# Altium project PCB_Project_Dangrangto.PrjPcb
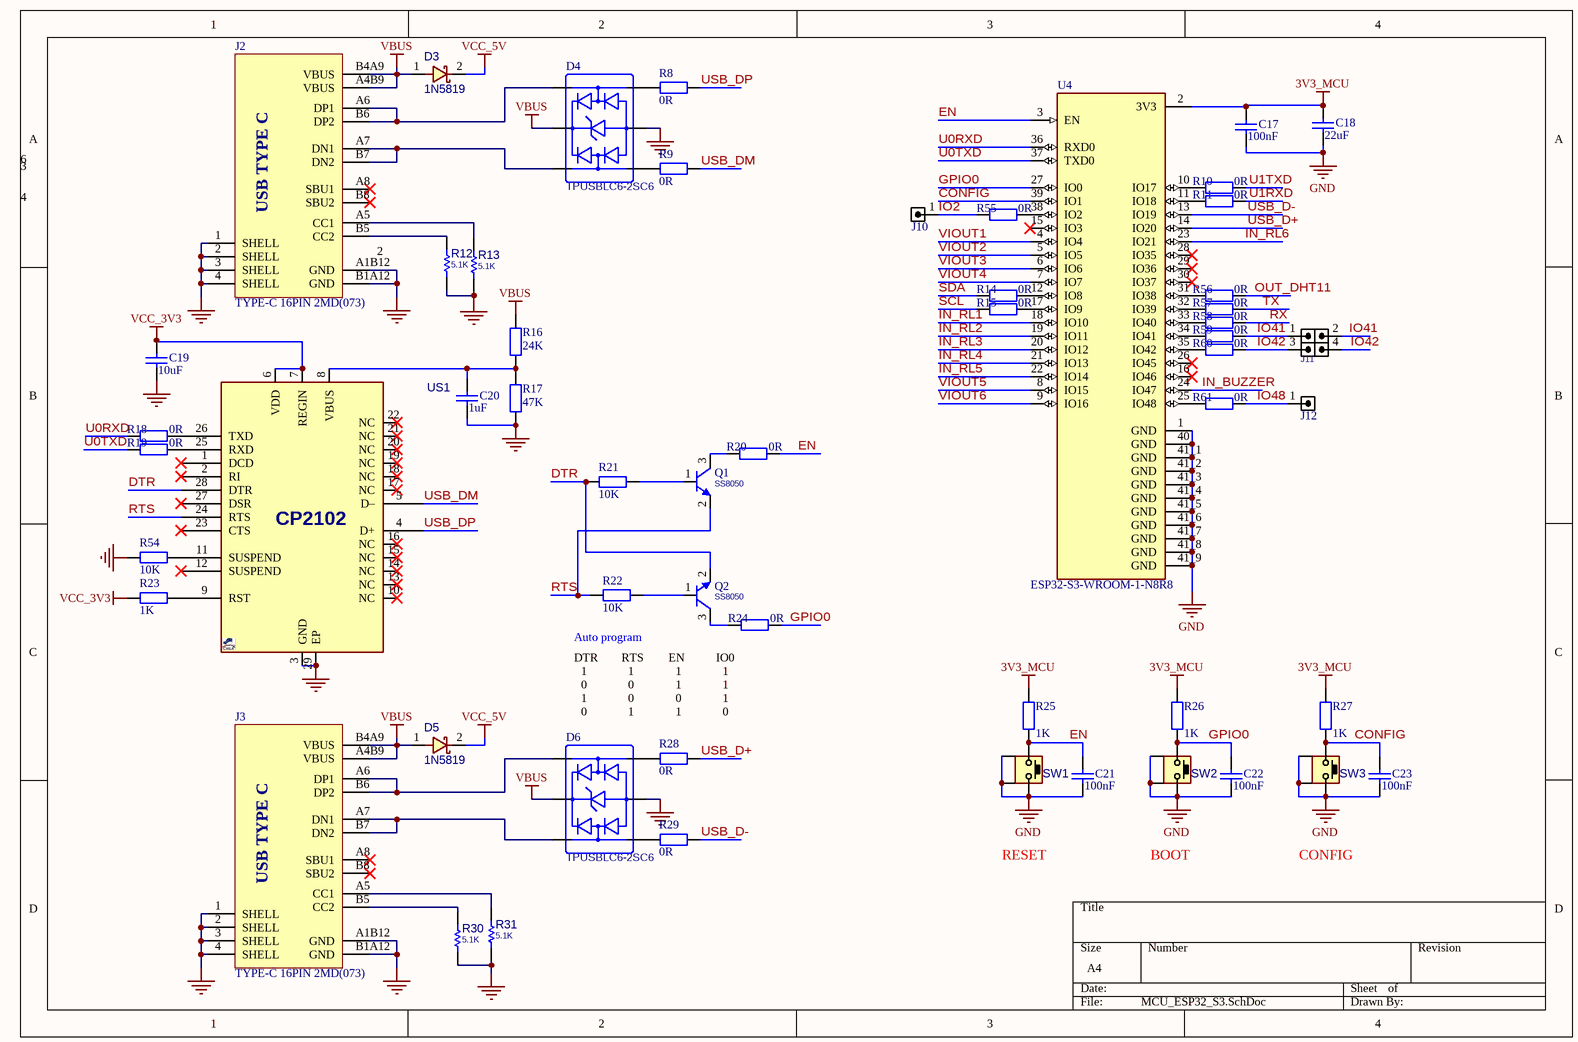
[diagram p0: MCU_ESP32_S3.SchDoc]
1 sheet, 55 parts. Net scope: global (net labels, ports and power ports of the same name join across sheets).
Board file: PCB_Project_Dangrangto.PcbDoc

## Sheet MCU_ESP32_S3.SchDoc
size A4; SheetNumber: 2; SheetTotal: 5

### Parts
C17  Ma_Hang: 100nF  [tu 0603]  (hidden comment: 100nF_0603_1%)
C18  Ma_Hang: 22uF  [tu 0603]  (hidden comment: 22uF_0603_1%)
C19  Ma_Hang: 10uF  [tu 0603]  (hidden comment: 10uF_0603_1%)
C20  Ma_Hang: 1uF  [tu 0603]  (hidden comment: 1uF_0603_1%)
C21  Ma_Hang: 100nF  [tu 0603]  (hidden comment: 100nF_0603_1%)
C22  Ma_Hang: 100nF  [tu 0603]  (hidden comment: 100nF_0603_1%)
C23  Ma_Hang: 100nF  [tu 0603]  (hidden comment: 100nF_0603_1%)
D3  value 1N5819  [D_SOD123W]  (hidden comment: 1N5819_DO213)
D4  TPUSBLC6-2SC6  [SOT-23-6_L2.9-W1.6-P0.95-LS2.8-BR]
D5  value 1N5819  [D_SOD123W]  (hidden comment: 1N5819_DO213)
D6  TPUSBLC6-2SC6  [SOT-23-6_L2.9-W1.6-P0.95-LS2.8-BR]
J2  TYPE-C 16PIN 2MD(073)  [USB-C-SMD_TYPE-C16PIN]
J3  TYPE-C 16PIN 2MD(073)  [USB-C-SMD_TYPE-C16PIN]
J10  HDRM1  [HDR_M_1]  (value not drawn)
J11  HDR2M_2X2  [HDR2_M_2X2]  (value not drawn)
J12  HDRM1  [HDR_M_1]  (value not drawn)
Q1  SS8050  [SOT23_3]
Q2  SS8050  [SOT23_3]
R8  Ma_Hang: 0R  [tro smd 0603]  (hidden comment: 0R_0603_1%)
R9  Ma_Hang: 0R  [tro smd 0603]  (hidden comment: 0R_0603_1%)
R10  Ma_Hang: 0R  [tro smd 0603]  (hidden comment: 0R_0603_1%)
R11  Ma_Hang: 0R  [tro smd 0603]  (hidden comment: 0R_0603_1%)
R12  value 5.1K  [R0603]  (hidden comment: 5K1_0603_1%)
R13  value 5.1K  [R0603]  (hidden comment: 5K1_0603_1%)
R14  Ma_Hang: 0R  [tro smd 0603]  (hidden comment: 0R_0603_1%)
R15  Ma_Hang: 0R  [tro smd 0603]  (hidden comment: 0R_0603_1%)
R16  Ma_Hang: 24K  [tro smd 0603]  (hidden comment: 24K_0603_1%)
R17  Ma_Hang: 47K  [tro smd 0603]  (hidden comment: 47K_0603_1%)
R18  Ma_Hang: 0R  [tro smd 0603]  (hidden comment: 0R_0603_1%)
R19  Ma_Hang: 0R  [tro smd 0603]  (hidden comment: 0R_0603_1%)
R20  Ma_Hang: 0R  [tro smd 0603]  (hidden comment: 0R_0603_1%)
R21  Ma_Hang: 10K  [tro smd 0603]  (hidden comment: 10K_0603_1%)
R22  Ma_Hang: 10K  [tro smd 0603]  (hidden comment: 10K_0603_1%)
R23  Ma_Hang: 1K  [tro smd 0603]  (hidden comment: 1K_0603_1%)
R24  Ma_Hang: 0R  [tro smd 0603]  (hidden comment: 0R_0603_1%)
R25  Ma_Hang: 1K  [tro smd 0603]  (hidden comment: 1K_0603_1%)
R26  Ma_Hang: 1K  [tro smd 0603]  (hidden comment: 1K_0603_1%)
R27  Ma_Hang: 1K  [tro smd 0603]  (hidden comment: 1K_0603_1%)
R28  Ma_Hang: 0R  [tro smd 0603]  (hidden comment: 0R_0603_1%)
R29  Ma_Hang: 0R  [tro smd 0603]  (hidden comment: 0R_0603_1%)
R30  value 5.1K  [R0603]  (hidden comment: 5K1_0603_1%)
R31  value 5.1K  [R0603]  (hidden comment: 5K1_0603_1%)
R54  Ma_Hang: 10K  [tro smd 0603]  (hidden comment: 10K_0603_1%)
R55  Ma_Hang: 0R  [tro smd 0603]  (hidden comment: 0R_0603_1%)
R56  Ma_Hang: 0R  [tro smd 0603]  (hidden comment: 0R_0603_1%)
R57  Ma_Hang: 0R  [tro smd 0603]  (hidden comment: 0R_0603_1%)
R58  Ma_Hang: 0R  [tro smd 0603]  (hidden comment: 0R_0603_1%)
R59  Ma_Hang: 0R  [tro smd 0603]  (hidden comment: 0R_0603_1%)
R60  Ma_Hang: 0R  [tro smd 0603]  (hidden comment: 0R_0603_1%)
R61  Ma_Hang: 0R  [tro smd 0603]  (hidden comment: 0R_0603_1%)
SW1  PUSHBUTTON  [SWPBT_SPST_R_6X6X10]  (value not drawn)
SW2  PUSHBUTTON  [SWPBT_SPST_R_6X6X10]  (value not drawn)
SW3  PUSHBUTTON  [SWPBT_SPST_R_6X6X10]  (value not drawn)
U4  ESP32-S3-WROOM-1-N8R8  [XCVR_ESP32S3WROOM1N8R8]
US1  CP2102_QFN28  [QFN50_28T]  (value not drawn)

### Nets
3V3_MCU: C17.1 C18.1 R25.2 R26.2 R27.2 U4.2(3V3)
GND: C17.2 C18.2 C19.2 C20.2 C21.2 C22.2 C23.2 D4.2(GND) D6.2(GND) J2.1(SHELL) J2.2(SHELL) J2.3(SHELL) J2.4(SHELL) J2.A1B12(GND) J2.B1A12(GND) J3.1(SHELL) J3.2(SHELL) J3.3(SHELL) J3.4(SHELL) J3.A1B12(GND) J3.B1A12(GND) R12.2 R13.2 R17.2 R30.2 R31.2 R54.2 SW1.2 SW1.MH1 SW1.MH2 SW2.2 SW2.MH1 SW2.MH2 SW3.2 SW3.MH1 SW3.MH2 U4.1(GND) U4.40(GND) U4.41_1(GND) U4.41_2(GND) U4.41_3(GND) U4.41_4(GND) U4.41_5(GND) U4.41_6(GND) U4.41_7(GND) U4.41_8(GND) U4.41_9(GND) US1.3(GND) US1.29(EP)
VBUS: D3.1 D4.5(VBUS) D5.1 D6.5(VBUS) J2.A4B9(VBUS) J2.B4A9(VBUS) J3.A4B9(VBUS) J3.B4A9(VBUS) R16.1
VCC_3V3: C19.1 R23.1 US1.6(VDD) US1.7(REGIN)
VCC_5V: D3.2 D5.2
CONFIG: C23.1 R27.1 SW3.1 U4.39(IO1)
DTR: Q2.2(E) R21.2 US1.28(DTR)
EN: C21.1 R20.2 R25.1 SW1.1 U4.3(EN)
GPIO0: C22.1 R24.2 R26.1 SW2.1 U4.27(IO0)
IN_BUZZER: U4.24(IO47)
IN_RL1: U4.18(IO10)
IN_RL2: U4.19(IO11)
IN_RL3: U4.20(IO12)
IN_RL4: U4.21(IO13)
IN_RL5: U4.22(IO14)
IN_RL6: U4.23(IO21)
IO2: J10.1 R55.1
IO41: J11.1 J11.2 R59.2
IO42: J11.3 J11.4 R60.2
IO48: J12.1 R61.2
OUT_DHT11: R56.2
RTS: Q1.2(E) R22.2 US1.24(RTS)
RX: R58.2
SCL: R15.1
SDA: R14.1
TX: R57.2
U0RXD: R18.1 U4.36(RXD0)
U0TXD: R19.1 U4.37(TXD0)
U1RXD: R11.2
U1TXD: R10.2
USB_D+: R28.2 U4.14(IO20)
USB_D-: R29.2 U4.13(IO19)
USB_DM: R9.2 US1.5(D–)
USB_DP: R8.2 US1.4(D+)
VIOUT1: U4.4(IO4)
VIOUT2: U4.5(IO5)
VIOUT3: U4.6(IO6)
VIOUT4: U4.7(IO7)
VIOUT5: U4.8(IO15)
VIOUT6: U4.9(IO16)
NetC20_1: C20.1 R16.2 R17.1 US1.8(VBUS)
NetD4_1: D4.1(I/O1) R8.1
NetD4_3: D4.3(I/O2) R9.1
NetD4_4: D4.4(I/O2) J2.A7(DN1) J2.B7(DN2)
NetD4_6: D4.6(I/O1) J2.A6(DP1) J2.B6(DP2)
NetD6_1: D6.1(I/O1) R28.1
NetD6_3: D6.3(I/O2) R29.1
NetD6_4: D6.4(I/O2) J3.A7(DN1) J3.B7(DN2)
NetD6_6: D6.6(I/O1) J3.A6(DP1) J3.B6(DP2)
NetJ2_A5: J2.A5(CC1) R13.1
NetJ2_B5: J2.B5(CC2) R12.1
NetJ3_A5: J3.A5(CC1) R31.1
NetJ3_B5: J3.B5(CC2) R30.1
NetQ1_1: Q1.1(B) R21.1
NetQ1_3: Q1.3(C) R20.1
NetQ2_1: Q2.1(B) R22.1
NetQ2_3: Q2.3(C) R24.1
NetR10_1: R10.1 U4.10(IO17)
NetR11_1: R11.1 U4.11(IO18)
NetR14_2: R14.2 U4.12(IO8)
NetR15_2: R15.2 U4.17(IO9)
NetR18_2: R18.2 US1.26(TXD)
NetR19_2: R19.2 US1.25(RXD)
NetR23_2: R23.2 US1.9(RST)
NetR54_1: R54.1 US1.11(SUSPEND)
NetR55_2: R55.2 U4.38(IO2)
NetR56_1: R56.1 U4.31(IO38)
NetR57_1: R57.1 U4.32(IO39)
NetR58_1: R58.1 U4.33(IO40)
NetR59_1: R59.1 U4.34(IO41)
NetR60_1: R60.1 U4.35(IO42)
NetR61_1: R61.1 U4.25(IO48)

Not connected (* = marked no-connect by the designer): J2 A8(SBU1)* B8(SBU2)*; J3 A8(SBU1)* B8(SBU2)*; U4 15(IO3)* 16(IO46)* 26(IO45)* 28(IO35)* 29(IO36)* 30(IO37)*; US1 1(DCD)* 2(RI)* 10(NC)* 12(SUSPEND)* 13(NC)* 14(NC)* 15(NC)* 16(NC)* 17(NC)* 18(NC)* 19(NC)* 20(NC)* 21(NC)* 22(NC)* 23(CTS)* 27(DSR)*

### Notes on the sheet
- 3
- 6
- 4
- (near J2) 2
- Auto program
- DTR
- RTS
- EN
- IO0
- 1
- 0
- (near D6) 1
- (near D6) 0
- RESET
- BOOT
- CONFIG
- (in symbol TYPE-C 16PIN 2MD(073)) USB TYPE C

### Library data of the parts
C17-C23 = Tu 0603 470pF 50V 10%: Capacitor, Ceramic, 50V; Chung_Loai: Dán; Don_Vi: Con; So_Chan: 2; Ten_Linh_Kien: Tụ 0603 470P 50V 10%; Kieu_Chan: *
D3 D5 = DIODE_SMD_SCHOTTKY_1N5819: DIODE, SCHOTTKY, 40V, 1A; MANF: DIODES; MANF_P#: 1N5819HW-7-F; DESC: DESCRIPTION; ASSEMBLY: ASSEMBLY; PRICE: PRICE; PARAM2: 1A; PARAM: 40V
D4 D6 = ESD_TPUSBLC6-2SC6: ESD ROHS SOT23-6 DIODES; Manufacturer: TECH PUBLIC; LCSC Part Number: C558442; Manufacturer Part Number: TPUSBLC6-2SC6; Package: SOT-23-6; Assembly Type: SMT Assembly
J2 J3 = TYPE-C 16PIN 2MD(073): 5A 1 Surface Mount 16 Female -25℃~+85℃ Type-C SMD USB Connectors ROHS; Manufacturer: SHOU HAN; Manufacturer Part Number: TYPE-C16PIN; LCSC Part Number: C2765186; Package: SMD; Assembly Type: SMT Assembly
J10 J12 = HDR_M_1: CONN, HEADER, Male, pitch: 2.54mm, 1POS; VALUE: HDRM1
J11 = HDR2_M_2X2: CONN, HEADER, Male, pitch: 2mm, 4POS; MANF_P#: MANF_PART#; MANF: MANF; VALUE: HDR2M_2X2
Q1 Q2 = NPN_MMBT8050_SOT23: BJT, NPN, 25v, 1.5A, SMD, SOT23; PARAM2: 300mW; MANF: GALAXY; PARAM: 25v, 1.5A; MANF_P#: MMBT8050; PRICE: 0.09t@JAVAN; VALUE: SS8050
R8-R11 R14-R29 R54-R61 = Tro 0603 5% 10k: RES SMD 0603; Chung_Loai: Dán; Don_Vi: Con; So_Chan: 2; Ten_Linh_Kien: Trở 0603 5% 10k; Kieu_Chan: *
R12 R13 R30 R31 = RES_SMD_0603: RESISTOR, SMD; PARAM: -W; DESC: DESCRIPTION; DIST#: MOUSER; PARAM2: 1%; MANF_P#: -; MANF: -; ASSEMBLY: ASSEMBLY; PRICE: 100= 0.5$
SW1-SW3 = SWPBT_SPST_R_6X6X10: SWITCH, PUSH BUTTON, TACTILE, THD, SPST, RIGHT; PARAM: 50mA/12VDC; DESC: DESCRIPTION; MANF: -; VALUE: PUSHBUTTON; ASSEMBLY: ASSEMBLY; PRICE: 0.3$; MANF_P#: -
U4 = ESP32-S3-WROOM-1-N8R8: Bluetooth, WiFi 802.11b/g/n, Bluetooth v5.0 Transceiver Module 2.4GHz PCB Trace Surface Mount; MF: Espressif Systems; Package: None; Price: None; Check_prices: https://www.snapeda.com/parts/ESP32-S3-WROOM-1-N8R8/Espressif+Systems/view-part/?ref=eda; Value: *; SnapEDA_Link: https://www.snapeda.com/parts/ESP32-S3-WROOM-1-N8R8/Espressif+Systems/view-part/?ref=snap; MP: ESP32-S3-WROOM-1-N8R8; Availability: In Stock; Purchase-URL: https://pricing.snapeda.com/search?q=ESP32-S3-WROOM-1-N8R8&ref=eda
US1 = CP2102_QFN28: USB-UART BRIDGE; MANF: SILICON LABS; DESC: DESCRIPTION; MANF_P#: CP2102; PARAM2: 3.3V; VALUE: CP2102; MANF: MANF; ASSEMBLY: ASSEMBLY; PRICE: PRICE